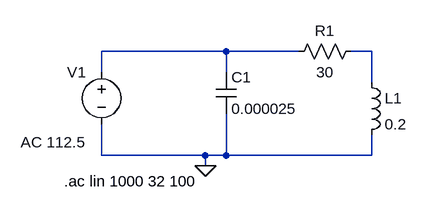
[diagram p0: schematic Draft1.asc]
Draft1.asc, the LTspice schematic file:
Version 4
SHEET 1 880 680
WIRE 288 96 96 96
WIRE 400 96 288 96
WIRE 512 96 480 96
WIRE 96 128 96 96
WIRE 288 128 288 96
WIRE 512 144 512 96
WIRE 96 256 96 208
WIRE 256 256 96 256
WIRE 288 256 288 192
WIRE 288 256 256 256
WIRE 512 256 512 224
WIRE 512 256 288 256
WIRE 256 272 256 256
FLAG 256 272 0
SYMBOL res 384 112 R270
WINDOW 0 32 56 VTop 2
WINDOW 3 0 56 VBottom 2
SYMATTR InstName R1
SYMATTR Value 30
SYMBOL ind 496 128 R0
SYMATTR InstName L1
SYMATTR Value 0.2
SYMBOL voltage 96 112 M0
WINDOW 123 24 124 Left 2
WINDOW 39 0 0 Left 2
SYMATTR InstName V1
SYMATTR Value ""
SYMATTR Value2 AC 112.5
SYMBOL cap 272 128 R0
SYMATTR InstName C1
SYMATTR Value 0.000025
TEXT 38 296 Left 2 !.ac lin 1000 32 100

The netlist it stands for:
* Draft1.asc
R1 N001 N002 30
L1 N002 0 0.2
V1 N001 0 AC 112.5
C1 N001 0 0.000025
.ac lin 1000 32 100
.backanno
.end